# Altium schematic sheet stm32h750xbh6-pwr.SchDoc: MCUA
size A4; Date: 10.04.2025; CheckedBy: BCY; DrawnBy: miaow; DocumentNumber: 6; Revision: v0.0.1; SheetNumber: 6; SheetTotal: 12; Sample: A0; Url: github.com/miaow-cn/pcb-lib; Liscense: GPLv3; Board: MIAOW FOC BOARD; BoardType: MAIN_PCB; Desc: power part of stm32h750xbh6
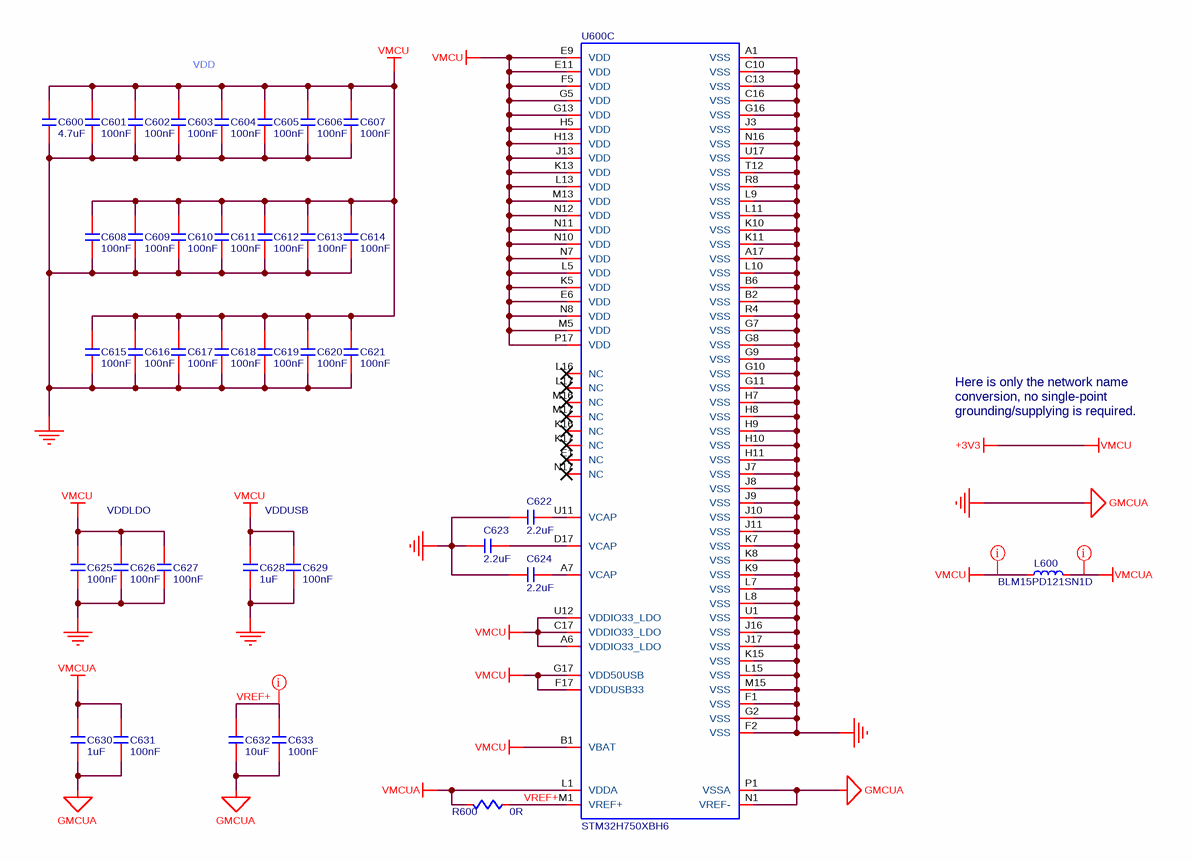
[diagram p0: stm32h750xbh6-pwr.SchDoc]

## Parts
C600  value 4.7uF  [C0603]  (hidden comment: C-NOMO)
C601  value 100nF  [C0402]  (hidden comment: C-NOMO)
C602  value 100nF  [C0402]  (hidden comment: C-NOMO)
C603  value 100nF  [C0402]  (hidden comment: C-NOMO)
C604  value 100nF  [C0402]  (hidden comment: C-NOMO)
C605  value 100nF  [C0402]  (hidden comment: C-NOMO)
C606  value 100nF  [C0402]  (hidden comment: C-NOMO)
C607  value 100nF  [C0402]  (hidden comment: C-NOMO)
C608  value 100nF  [C0402]  (hidden comment: C-NOMO)
C609  value 100nF  [C0402]  (hidden comment: C-NOMO)
C610  value 100nF  [C0402]  (hidden comment: C-NOMO)
C611  value 100nF  [C0402]  (hidden comment: C-NOMO)
C612  value 100nF  [C0402]  (hidden comment: C-NOMO)
C613  value 100nF  [C0402]  (hidden comment: C-NOMO)
C614  value 100nF  [C0402]  (hidden comment: C-NOMO)
C615  value 100nF  [C0402]  (hidden comment: C-NOMO)
C616  value 100nF  [C0402]  (hidden comment: C-NOMO)
C617  value 100nF  [C0402]  (hidden comment: C-NOMO)
C618  value 100nF  [C0402]  (hidden comment: C-NOMO)
C619  value 100nF  [C0402]  (hidden comment: C-NOMO)
C620  value 100nF  [C0402]  (hidden comment: C-NOMO)
C621  value 100nF  [C0402]  (hidden comment: C-NOMO)
C622  value 2.2uF  [C0603]  (hidden comment: C-NOMO)
C623  value 2.2uF  [C0603]  (hidden comment: C-NOMO)
C624  value 2.2uF  [C0603]  (hidden comment: C-NOMO)
C625  value 100nF  [C0402]  (hidden comment: C-NOMO)
C626  value 100nF  [C0402]  (hidden comment: C-NOMO)
C627  value 100nF  [C0402]  (hidden comment: C-NOMO)
C628  value 1uF  [C0603]  (hidden comment: C-NOMO)
C629  value 100nF  [C0402]  (hidden comment: C-NOMO)
C630  value 1uF  [C0603]  (hidden comment: C-NOMO)
C631  value 100nF  [C0402]  (hidden comment: C-NOMO)
C632  value 10uF  [C0805]  (hidden comment: C-NOMO)
C633  value 100nF  [C0402]  (hidden comment: C-NOMO)
L600  BLM15PD121SN1D  [L0402]
R600  value 0R  [R0603]  (hidden comment: R)
U600  STM32H750XBH6  [STM32H750XBH6]  (part C of 3)

## Nets
+3V3: C600.2 C601.2 C602.2 C603.2 C604.2 C605.2 C606.2 C607.2 C608.2 C609.2 C610.2 C611.2 C612.2 C613.2 C614.2 C615.2 C616.2 C617.2 C618.2 C619.2 C620.2 C621.2 C625.2 C626.2 C627.2 C628.2 C629.2 L600.1 U600.A6(VDDIO33_LDO) U600.B1(VBAT) U600.C17(VDDIO33_LDO) U600.E6(VDD) U600.E9(VDD) U600.E11(VDD) U600.F5(VDD) U600.F17(VDDUSB33) U600.G5(VDD) U600.G13(VDD) U600.G17(VDD50USB) U600.H5(VDD) U600.H13(VDD) U600.J13(VDD) U600.K5(VDD) U600.K13(VDD) U600.L5(VDD) U600.L13(VDD) U600.M5(VDD) U600.M13(VDD) U600.N7(VDD) U600.N8(VDD) U600.N10(VDD) U600.N11(VDD) U600.N12(VDD) U600.P17(VDD) U600.U12(VDDIO33_LDO)  [also labelled VMCU]
GMCUA: C600.1 C601.1 C602.1 C603.1 C604.1 C605.1 C606.1 C607.1 C608.1 C609.1 C610.1 C611.1 C612.1 C613.1 C614.1 C615.1 C616.1 C617.1 C618.1 C619.1 C620.1 C621.1 C622.1 C623.1 C624.1 C625.1 C626.1 C627.1 C628.1 C629.1 C630.1 C631.1 C632.1 C633.1 U600.A1(VSS) U600.A17(VSS) U600.B2(VSS) U600.B6(VSS) U600.C10(VSS) U600.C13(VSS) U600.C16(VSS) U600.F1(VSS) U600.F2(VSS) U600.G2(VSS) U600.G7(VSS) U600.G8(VSS) U600.G9(VSS) U600.G10(VSS) U600.G11(VSS) U600.G16(VSS) U600.H7(VSS) U600.H8(VSS) U600.H9(VSS) U600.H10(VSS) U600.H11(VSS) U600.J3(VSS) U600.J7(VSS) U600.J8(VSS) U600.J9(VSS) U600.J10(VSS) U600.J11(VSS) U600.J16(VSS) U600.J17(VSS) U600.K7(VSS) U600.K8(VSS) U600.K9(VSS) U600.K10(VSS) U600.K11(VSS) U600.K15(VSS) U600.L7(VSS) U600.L8(VSS) U600.L9(VSS) U600.L10(VSS) U600.L11(VSS) U600.L15(VSS) U600.M15(VSS) U600.N1(VREF-) U600.N16(VSS) U600.P1(VSSA) U600.R4(VSS) U600.R8(VSS) U600.T12(VSS) U600.U1(VSS) U600.U17(VSS)  [also labelled GND]
VMCUA: C630.2 C631.2 L600.2 R600.1 U600.L1(VDDA)
VREF+: C632.2 C633.2 R600.2 U600.M1(VREF+)
NetC622_2: C622.2 U600.U11(VCAP)
NetC623_2: C623.2 U600.D17(VCAP)
NetC624_2: C624.2 U600.A7(VCAP)

Not connected (* = marked no-connect by the designer): U600 E1(NC)* K16(NC)* K17(NC)* L16(NC)* L17(NC)* M16(NC)* M17(NC)* N17(NC)*

## Layout directives
net class CLS_PWR: +3V3, VMCUA, VREF+

## Notes on the sheet
- VDD
- Here is only the network name conversion, no single-point grounding/supplying is required.
- VDDLDO
- VDDUSB
- DRAWN
- CHECKED
- DRAWNBY
- SHEETS
- SHEETS_NO

## Library data of the parts
C600-C633 = C-NOMO: voltage: 25V; precision: 5%
L600 = L: Code_IEC: 1005; Value: 120R@100MHz; Published: 8-Jun-2000; LatestRevisionDate: 29-May-2009; LatestRevisionNote: IPC-7351 Footprint Added.; PackageReference: 0402-A; Publisher: Altium Limited; PackageDescription: Chip Inductor; Code_JEITA: 0402
R600 = R: precision: 1%
U600 = STM32H750XBH6: MCU; Supplier 1: LCSC; Supplier Part Number 1: C405932